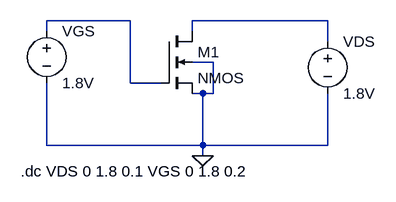
[diagram p0: schematic nmos_180.asc]
nmos_180.asc, the LTspice schematic file:
Version 4.1
SHEET 1 880 680
WIRE 240 -16 112 -16
WIRE 544 -16 336 -16
WIRE 112 0 112 -16
WIRE 336 0 336 -16
WIRE 544 16 544 -16
WIRE 368 48 336 48
WIRE 240 80 240 -16
WIRE 288 80 240 80
WIRE 352 96 336 96
WIRE 368 96 368 48
WIRE 368 96 352 96
WIRE 112 176 112 80
WIRE 352 176 352 96
WIRE 352 176 112 176
WIRE 544 176 544 96
WIRE 544 176 352 176
WIRE 352 192 352 176
FLAG 352 192 0
SYMBOL nmos4 288 0 R0
SYMATTR InstName M1
SYMATTR Value2 l=180n w=270n
SYMBOL voltage 112 -16 R0
SYMATTR InstName VGS
SYMATTR Value 1.8V
SYMBOL voltage 544 0 R0
SYMATTR InstName VDS
SYMATTR Value 1.8V
TEXT 72 216 Left 2 !.dc VDS 0 1.8 0.1 VGS 0 1.8 0.2

The netlist it stands for:
* nmos_180.asc
M1 N002 N001 0 0 NMOS l=180n w=270n
VGS N001 0 1.8V
VDS N002 0 1.8V
.model NMOS NMOS
.model PMOS PMOS
.lib standard.mos
.dc VDS 0 1.8 0.1 VGS 0 1.8 0.2
.backanno
.end